# Altium schematic sheet 5V_Converter.SchDoc
size A
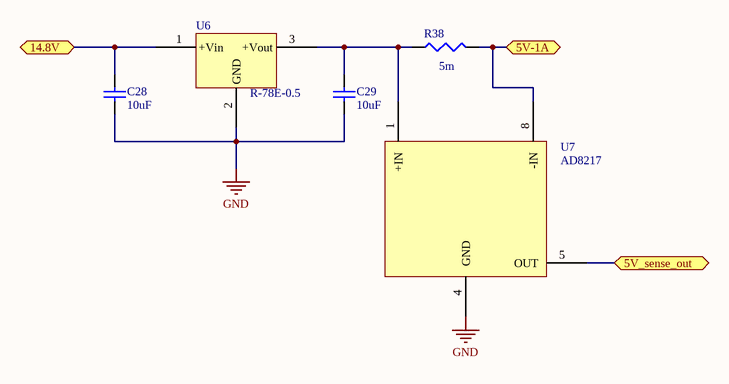
[diagram p0: 5V_Converter.SchDoc]

## Parts
C28  10uF  [C1206]
C29  10uF  [C1206]
R38  value 5m  [J1-0603]  (hidden comment: Res3)
U6  R-78E-0.5  [PCBComponent_1]
U7  AD8217  [TSOP65P490X110-8N]

## Ports
5V-1A, 5V_sense_out, 14.8V

## Nets
GND: C28.1 C29.1 U6.2(GND) U7.4(GND)
5V-1A: R38.2 U7.8(-IN) ; port 5V-1A
5V_sense_out: U7.5(OUT) ; port 5V_sense_out
14.8V: C28.2 U6.1(+Vin) ; port 14.8V
NetC29_2: C29.2 R38.1 U6.3(+Vout) U7.1(+IN)

## Library data of the parts
C28 C29 = Cap Semi: Capacitor (Semiconductor SIM Model); Published: 8-Jun-2000; LatestRevisionDate: 29-May-2009; LatestRevisionNote: IPC-7351 Footprint Added.; PackageReference: C1206; Publisher: Altium Limited; PackageDescription: Chip Capacitor; Value: 10uF
R38 = Res3: Resistor; Published: 8-Jun-2000; LatestRevisionDate: 29-May-2009; LatestRevisionNote: IPC-7351 Footprint Added.; PackageReference: J1-0603; Publisher: Altium Limited; PackageDescription: Chip Resistor
U6 = Component_1
U7 = Component_1: Current Shunt Moniter